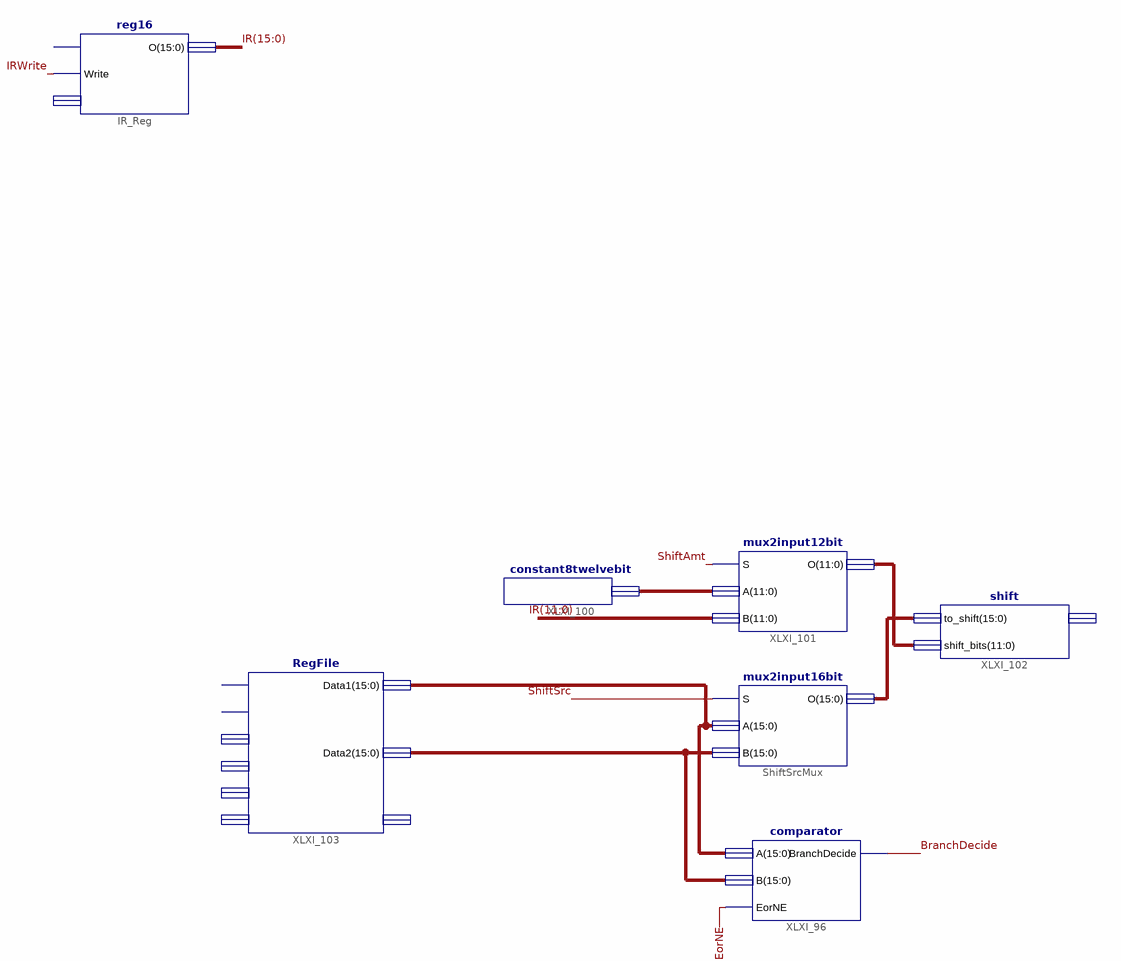
[diagram p0: schematic sheet 1]
// Xilinx ISE schematic RegandOtherCalc.sch (spartan3adsp) as structural Verilog: 7 symbols, 0 ports
module RegandOtherCalc (
);

  wire BranchDecide, EorNE, IRWrite, ShiftAmt, ShiftSrc;
  wire [11:0] XLXN_256, XLXN_272;
  wire [15:0] IR, XLXN_273, XLXN_278, XLXN_279;

  RegFile XLXI_103 (
    .Data1(XLXN_278), .Data2(XLXN_279));  // open: RegWrite, clock, Read1, Read2, WriteReg, WriteData, Data3
  mux2input12bit XLXI_101 (.S(ShiftAmt), .A(XLXN_256), .B(IR[11:0]), .O(XLXN_272));
  mux2input16bit ShiftSrcMux (.S(ShiftSrc), .A(XLXN_278), .B(XLXN_279), .O(XLXN_273));
  constant8twelvebit XLXI_100 (.O(XLXN_256));
  shift XLXI_102 (.to_shift(XLXN_273), .shift_bits(XLXN_272));  // open: shifted
  reg16 IR_Reg (.Write(IRWrite), .O(IR));  // open: CLK, I
  comparator XLXI_96 (.A(XLXN_278), .B(XLXN_279), .EorNE(EorNE), .BranchDecide(BranchDecide));
endmodule
